# Altium project FG Main PCB.PrjPcb
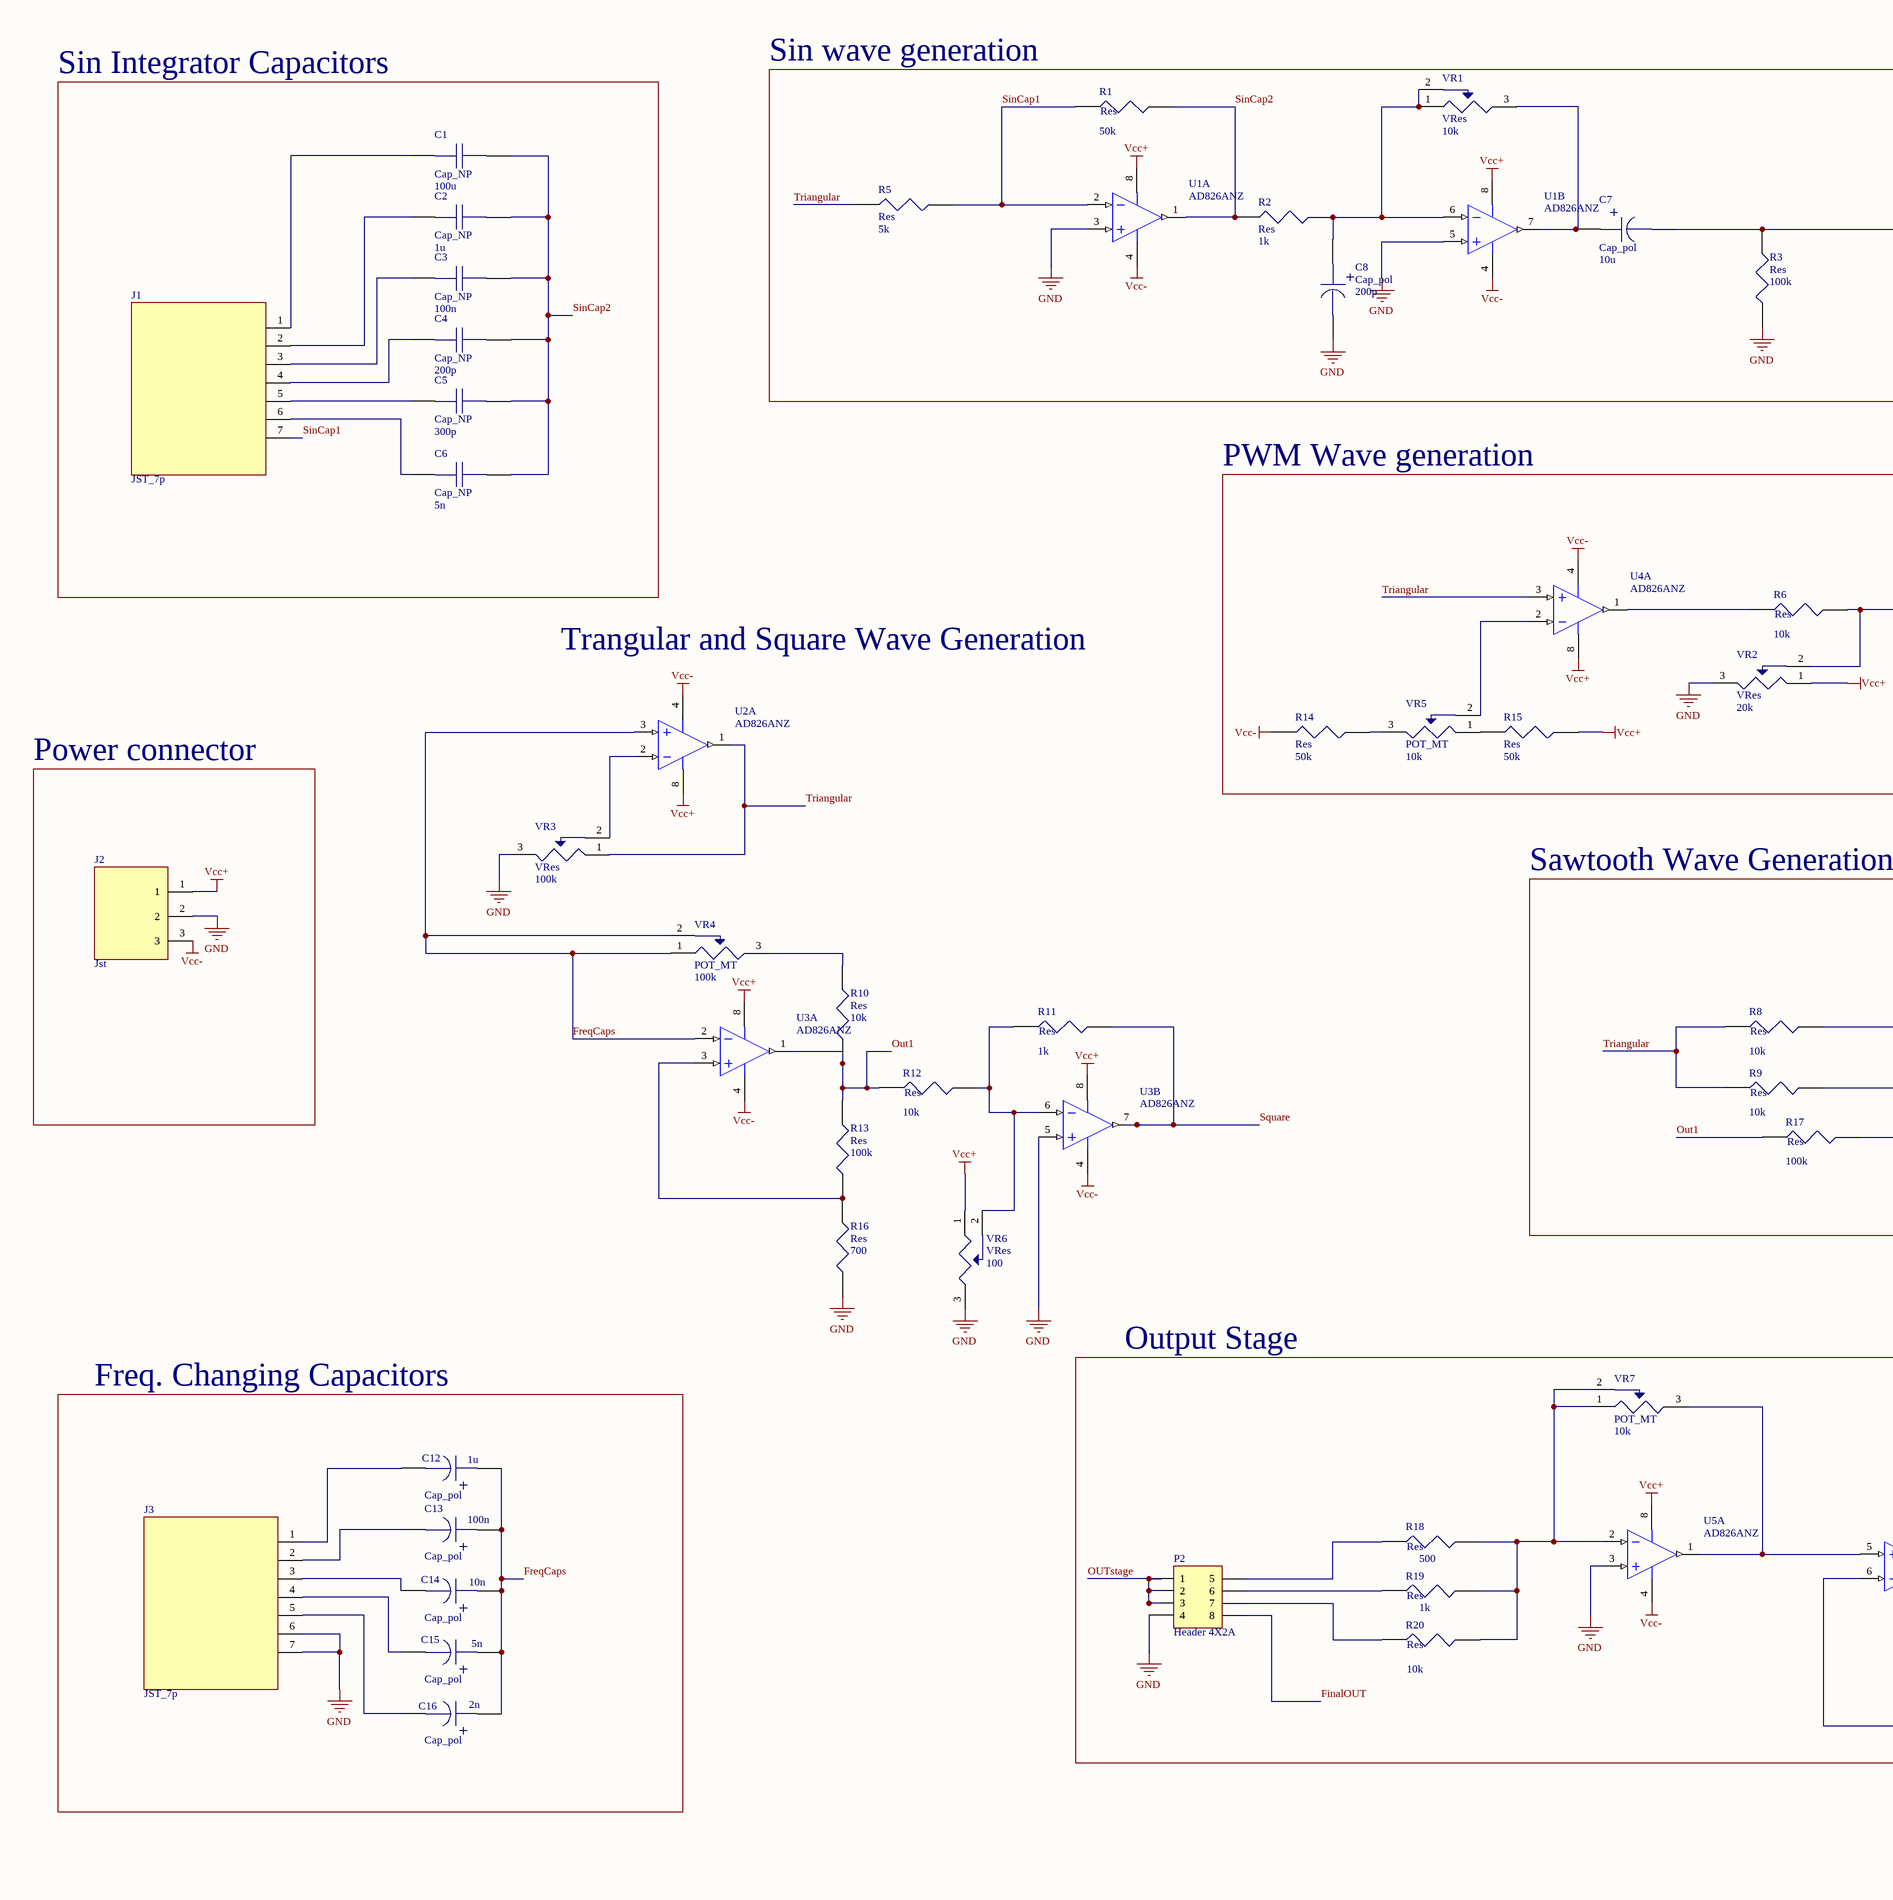
[diagram p0: Sheet1.SchDoc, left]
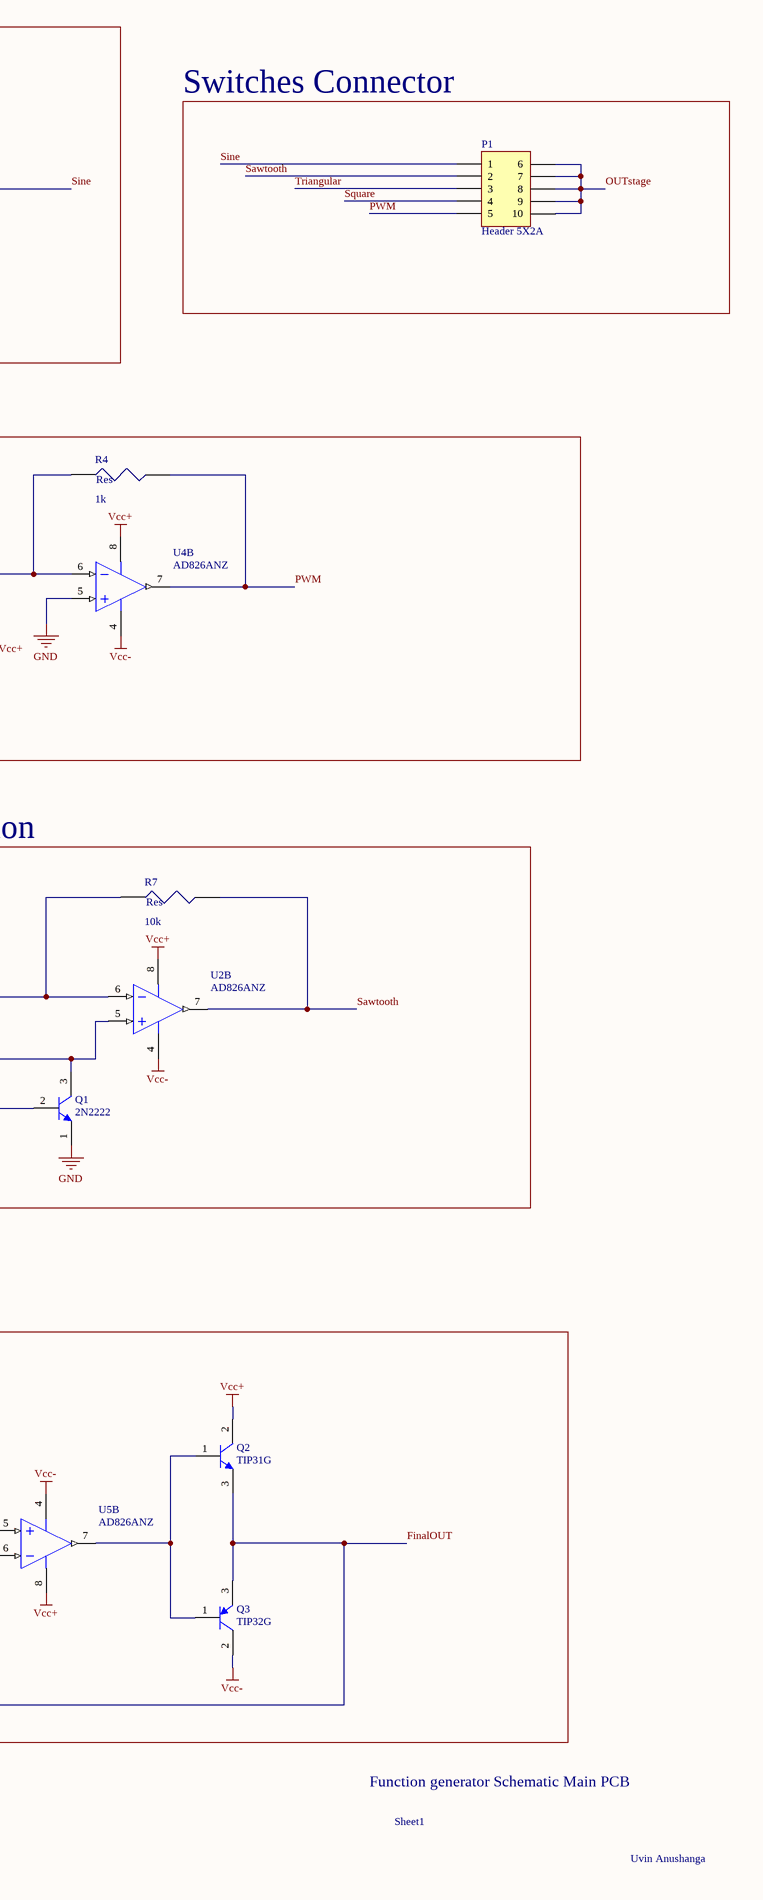
[diagram p1: Sheet1.SchDoc, right]
1 sheet, 53 parts. Net scope: global (net labels, ports and power ports of the same name join across sheets).
Board file: Main PCB.PcbDoc

## Sheet Sheet1.SchDoc
size A2; SheetNumber: 1; SheetTotal: 1

### Parts
C1  Cap_NP  value 100u  [Cap NP]
C2  Cap_NP  value 1u  [Cap NP]
C3  Cap_NP  value 100n  [Cap NP]
C4  Cap_NP  value 200p  [Cap NP]
C5  Cap_NP  value 300p  [Cap NP]
C6  Cap_NP  value 5n  [Cap NP]
C7  Cap_pol  value 10u  [Cap pol]
C8  Cap_pol  value 200p  [Cap pol]
C12  Cap_pol  value 1u  [Cap pol]
C13  Cap_pol  value 100n  [Cap pol]
C14  Cap_pol  value 10n  [Cap pol]
C15  Cap_pol  value 5n  [Cap pol]
C16  Cap_pol  value 2n  [Cap pol]
J1  JST_7p  [JST_7p]
J2  Jst  [Jst_3p]
J3  JST_7p  [JST_7p]
P1  Header 5X2A  [HDR2X5_CEN]
P2  Header 4X2A  [HDR2X4_CEN]
Q1  2N2222  [MLTC-TO-18-3]
Q2  TIP31G  [ONSC-TO-220-3-221A-09]
Q3  TIP32G  [ONSC-TO-220-3-221A-09]
R1  Res  value 50k  [Res]
R2  Res  value 1k  [Res]
R3  Res  value 100k  [Res]
R4  Res  value 1k  [Res]
R5  Res  value 5k  [Res]
R6  Res  value 10k  [Res]
R7  Res  value 10k  [Res]
R8  Res  value 10k  [Res]
R9  Res  value 10k  [Res]
R10  Res  value 10k  [Res]
R11  Res  value 1k  [Res]
R12  Res  value 10k  [Res]
R13  Res  value 100k  [Res]
R14  Res  value 50k  [Res]
R15  Res  value 50k  [Res]
R16  Res  value 700  [Res]
R17  Res  value 100k  [Res]
R18  Res  value 500  [Res]
R19  Res  value 1k  [Res]
R20  Res  value 10k  [Res]
U1  AD826ANZ  [ADI-N-8]  (parts A,B of 2)
U2  AD826ANZ  [ADI-N-8]  (parts A,B of 2)
U3  AD826ANZ  [ADI-N-8]  (parts A,B of 2)
U4  AD826ANZ  [ADI-N-8]  (parts A,B of 2)
U5  AD826ANZ  [ADI-N-8]  (parts A,B of 2)
VR1  VRes  value 10k  [VerRes]
VR2  VRes  value 20k  [VerRes]
VR3  VRes  value 100k  [VerRes]
VR4  POT_MT  value 100k  [POT MT]
VR5  POT_MT  value 10k  [POT MT]
VR6  VRes  value 100  [VerRes]
VR7  POT_MT  value 10k  [POT MT]

### Blocks framed on the sheet
Sin Integrator Capacitors: C1-C6 J1
Sin wave generation: C7 C8 R1-R3 R5 U1 VR1
Switches Connector: P1
PWM Wave generation: R4 R6 R14 R15 U4 VR2 VR5
Power connector: J2
Sawtooth Wave Generation: Q1 R7-R9 R17 U2
Output Stage: P2 Q2 Q3 R18-R20 U5 VR7
Freq. Changing Capacitors: C12-C16 J3

### Nets
GND: C8.2 J2.2 J3.6 J3.7 P2.4 Q1.1(E) R3.2 R16.2 U1.3(+IN_1) U1.5(+IN_2) U3.5(+IN_2) U4.5(+IN_2) U5.3(+IN_1) VR2.3 VR3.3 VR6.3
Vcc+: J2.1 Q2.2(C) R15.1 U1.8(+V) U2.8(+V) U3.8(+V) U4.8(+V) U5.8(+V) VR2.1 VR6.1
Vcc-: J2.3 Q3.2(C) R14.2 U1.4(-V) U2.4(-V) U3.4(-V) U4.4(-V) U5.4(-V)
FinalOUT: P2.8 Q2.3(E) Q3.3(E) U5.6(-IN_2)
FreqCaps: C12.1 C13.1 C14.1 C15.1 C16.1 U2.3(+IN_1) U3.2(-IN_1) VR4.1 VR4.2
Out1: R10.2 R12.1 R13.1 R17.1 U3.1(OUT_1)
OUTstage: P1.6 P1.7 P1.8 P1.9 P1.10 P2.1 P2.2 P2.3
PWM: P1.5 R4.2 U4.7(OUT_2)
Sawtooth: P1.2 R7.2 U2.7(OUT_2)
SinCap1: J1.7 R1.1 R5.1 U1.2(-IN_1)
SinCap2: C1.2 C2.2 C3.2 C4.2 C5.2 C6.2 R1.2 R2.1 U1.1(OUT_1)
Sine: C7.2 P1.1 R3.1
Square: P1.4 R11.2 U3.7(OUT_2)
Triangular: P1.3 R5.2 R8.1 R9.1 U2.1(OUT_1) U4.3(+IN_1) VR3.1
NetC1_1: C1.1 J1.1
NetC2_1: C2.1 J1.2
NetC3_1: C3.1 J1.3
NetC4_1: C4.1 J1.4
NetC5_1: C5.1 J1.5
NetC6_1: C6.1 J1.6
NetC7_1: C7.1 U1.7(OUT_2) VR1.3
NetC8_1: C8.1 R2.2 U1.6(-IN_2) VR1.1 VR1.2
NetC12_2: C12.2 J3.1
NetC13_2: C13.2 J3.2
NetC14_2: C14.2 J3.3
NetC15_2: C15.2 J3.4
NetC16_2: C16.2 J3.5
NetP2_5: P2.5 R18.1
NetP2_6: P2.6 R19.1
NetP2_7: P2.7 R20.1
NetQ1_2: Q1.2(B) R17.2
NetQ1_3: Q1.3(C) R9.2 U2.5(+IN_2)
NetQ2_1: Q2.1(B) Q3.1(B) U5.7(OUT_2)
NetR4_1: R4.1 R6.2 U4.6(-IN_2) VR2.2
NetR6_1: R6.1 U4.1(OUT_1)
NetR7_1: R7.1 R8.2 U2.6(-IN_2)
NetR10_1: R10.1 VR4.3
NetR11_1: R11.1 R12.2 U3.6(-IN_2) VR6.2
NetR13_2: R13.2 R16.1 U3.3(+IN_1)
NetR14_1: R14.1 VR5.3
NetR15_2: R15.2 VR5.1
NetR18_2: R18.2 R19.2 R20.2 U5.2(-IN_1) VR7.1 VR7.2
NetU2_2: U2.2(-IN_1) VR3.2
NetU4_2: U4.2(-IN_1) VR5.2
NetU5_1: U5.1(OUT_1) U5.5(+IN_2) VR7.3

### Notes on the sheet
- Trangular and Square Wave Generation
- Function generator Schematic Main PCB
- Sheet1
- Uvin Anushanga

### Library data of the parts
J2 = Jst_3p
P1 = Header 5X2A: Header, 5-Pin, Dual row; LatestRevisionDate: 17-Jul-2002; LatestRevisionNote: Re-released for DXP Platform.; Publisher: Altium Limited
P2 = Header 4X2A: Header, 4-Pin, Dual row; LatestRevisionDate: 17-Jul-2002; LatestRevisionNote: Re-released for DXP Platform.; Publisher: Altium Limited
Q1 = CMP-2000-05237-1: Low Power Bipolar NPN Transistor, 30 V, -65 to 200 degC, 3-Pin TO-18, RoHS, Bulk; Manufacturer: Multicomp; Pin Configuration: a; No. of Pins: 3; No. of Transistors: 1; Collector Emitter Voltage Vces: 400mV; Current Ic Continuous a Max: 800mA; Power Dissipation Pd: 500mW; Collector Emitter Voltage V(br)ceo: 30V; Gain Bandwidth ft Typ: 250MHz; Voltage Vcbo: 60V; DC Current Gain hFE: 100; Full Power Rating Temperature: 25degC; Current Ic @ Vce Sat: 150mA; SVHC: NoSVHC(19-Dec-2012); Package Reference: TO-18-3; Package Description: 3-Pin Transistor Outline Package (TO-18), Dia 5.54 mm, Pitch Pitch 1.485mm; Datasheet URL: http://www.farnell.com/datasheets/1662272.pdf; Transistor Case Style: TO-18; Continuous Collector Current Ic Max: 800mA; Manufacturer URL: http://uk.farnell.com/b/multicomp; DC Collector Current: 800mA; Hfe Min: 100; Transistor Polarity: NPN; Power Dissipation Ptot Max: 500mW; Package / Case: TO-18; Datasheet Version: Rev. 1.1, 05/2012; Gain Bandwidth ft Min: 250MHz; Current Ic hFE: 150mA
Q2 = CMP-1048-01131-1: Complementary Silicon Plastic Power Transistor, 3-Pin TO-220, Pb-Free, Tube; Manufacturer: On Semiconductor; IC Continuous (A): 3; Polarity: NPN; RoHS: TRUE; ComponentLink2Description: Datasheet; ComponentLink3URL: http://www.onsemi.com/pub_link/Collateral/221A-09.PDF; Packing: Tube; fT Min (MHz): 3; PackageReference: TO-220-3-221A-09; Mounting Technology: Through Hole; ComponentLink1Description: Manufacturer URL; ComponentLink1URL: http://www.onsemi.com/; ComponentLink2URL: http://www.onsemi.com/pub_link/Collateral/TIP31A-D.PDF; DatasheetVersion: Rev. 14; PartNumber: TIP31G; ComponentLink3Description: Package Specification; PackageDescription: 3-Pin Flange Mount, Vertical Straight Lead, Body 9.97 x 4.445 mm, Pitch 2.54 mm; PackageVersion: Rev. AG, 09/2011
Q3 = CMP-1048-01078-1: Complementary Silicon Plastic Power Transistor, 3-Pin TO-220, Pb-Free, Tube; Manufacturer: On Semiconductor; Polarity: PNP; IC Continuous (A): 3; DatasheetVersion: Rev. 14; PackageReference: TO-220-3-221A-09; ComponentLink3Description: Package Specification; Packing: Tube; Mounting Technology: Through Hole; ComponentLink1Description: Manufacturer URL; PackageDescription: 3-Pin Flange Mount, Vertical Straight Lead, Body 9.97 x 4.445 mm, Pitch 2.54 mm; ComponentLink2Description: Datasheet; RoHS: TRUE; ComponentLink3URL: http://www.onsemi.com/pub_link/Collateral/221A-09.PDF; PartNumber: TIP32G; ComponentLink1URL: http://www.onsemi.com/; ComponentLink2URL: http://www.onsemi.com/pub_link/Collateral/TIP31A-D.PDF; fT Min (MHz): 3; PackageVersion: Rev. AG, 09/2011
U1-U5 = CMP-0384-00249-1: Double Channel Low Power Operational Amplifier, 50 MHz BW, 350 V/us SR, Industrial, 8-pin DIP (N-8), Tube; Manufacturer: Analog Devices; Generic Part Number: AD826; V Span Max: 36V; Iq/Amp: 7.5mA; Input Offset Voltage: 500uV; Input Bias Current: 3.3uA; Amplifiers Per Package: 2; Small Signal Bandwidth: 50MHz; V Span Min: 5V; ComponentLink3URL: http:/www.analog.com/static/imported-files/packages/PKG_PDF/PDIP(N)/N_8.pdf; ComponentLink1URL: http://www.analog.com/en/index.html; PackageVersion: 070606-A; Slew Rate: 350V/us; ComponentLink1Description: Manufacturer URL; Mounting Technology: Through Hole; ComponentLink2Description: Datasheet; DatasheetVersion: Rev. C; PartNumber: AD826ANZ; ComponentLink3Description: Package Specification; PackageReference: N-8; PackageDescription: 8-Pin Plastic Dual In-Line Package, Row spacing 7.62 mm, Pitch 2.54 mm; ComponentLink2URL: http://www.analog.com/static/imported-files/data_sheets/AD826.pdf; Code_JEDEC: MS-001